# Altium schematic sheet DASH_V_3_LEDS_POWER.SchDoc
size A
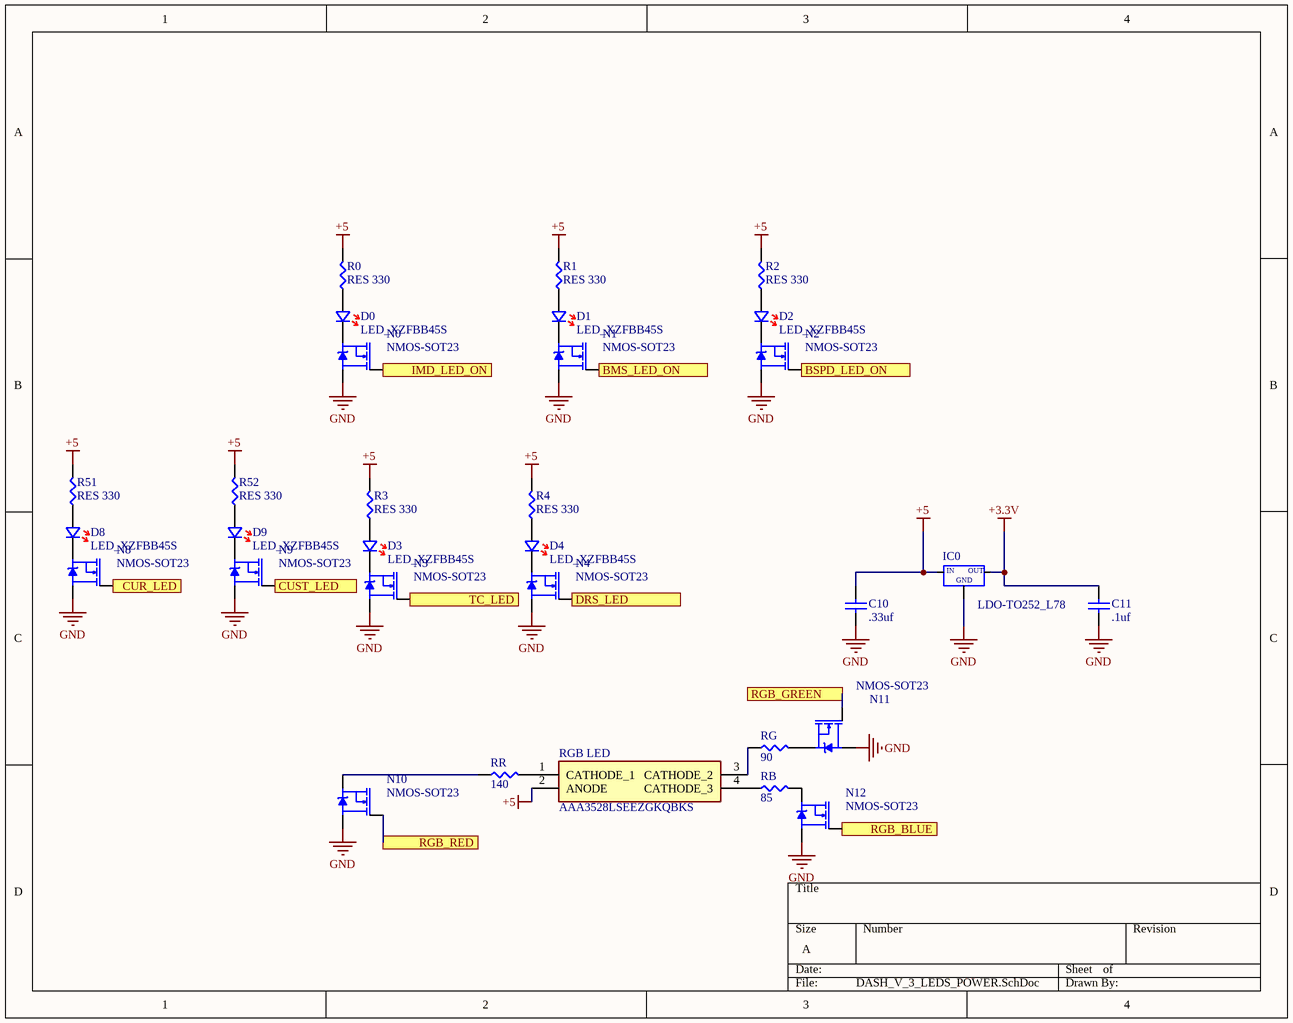
[diagram p0: DASH_V_3_LEDS_POWER.SchDoc]

## Parts
C10  .33uf  [CAPC1608X87X35NL15T15]
C11  .1uf  [CAPC1608X87X35NL15T15]
D0  LED_XZFBB45S  [LED_XZFBB45S]
D1  LED_XZFBB45S  [LED_XZFBB45S]
D2  LED_XZFBB45S  [LED_XZFBB45S]
D3  LED_XZFBB45S  [LED_XZFBB45S]
D4  LED_XZFBB45S  [LED_XZFBB45S]
D8  LED_XZFBB45S  [LED_XZFBB45S]
D9  LED_XZFBB45S  [LED_XZFBB45S]
IC0  LDO-TO252_L78  [TO252]
N0  NMOS-SOT23  [SOT23]
N1  NMOS-SOT23  [SOT23]
N2  NMOS-SOT23  [SOT23]
N3  NMOS-SOT23  [SOT23]
N4  NMOS-SOT23  [SOT23]
N8  NMOS-SOT23  [SOT23]
N9  NMOS-SOT23  [SOT23]
N10  NMOS-SOT23  [SOT23]
N11  NMOS-SOT23  [SOT23]
N12  NMOS-SOT23  [SOT23]
R0  RES 330  [RES-0603]
R1  RES 330  [RES-0603]
R2  RES 330  [RES-0603]
R3  RES 330  [RES-0603]
R4  RES 330  [RES-0603]
R51  RES 330  [RES-0603]
R52  RES 330  [RES-0603]
RB  85  [RES-0603]
RG  90  [RES-0603]
RGB_LED  AAA3528LSEEZGKQBKS  [AAA3528]
RR  140  [RES-0603]

## Ports
BMS_LED_ON, BSPD_LED_ON, CUR_LED, CUST_LED, DRS_LED, IMD_LED_ON, RGB_BLUE, RGB_GREEN, RGB_RED, TC_LED

## Nets
+3.3V: C11.2 IC0.3
+5: C10.2 IC0.1 R0.2 R1.2 R2.2 R3.2 R4.2 R51.2 R52.2 RGB_LED.2(ANODE)
GND: C10.1 C11.1 IC0.2 N0.2(S) N1.2(S) N2.2(S) N3.2(S) N4.2(S) N8.2(S) N9.2(S) N10.2(S) N11.2(S) N12.2(S)
BMS_LED_ON: N1.1(G) ; port BMS_LED_ON
BSPD_LED_ON: N2.1(G) ; port BSPD_LED_ON
CUR_LED: N8.1(G) ; port CUR_LED
CUST_LED: N9.1(G) ; port CUST_LED
DRS_LED: N4.1(G) ; port DRS_LED
IMD_LED_ON: N0.1(G) ; port IMD_LED_ON
RGB_BLUE: N12.1(G) ; port RGB_BLUE
RGB_GREEN: N11.1(G) ; port RGB_GREEN
RGB_RED: N10.1(G) ; port RGB_RED
TC_LED: N3.1(G) ; port TC_LED
NetD0_A: D0.A R0.1
NetD0_K: D0.K N0.3(D)
NetD1_A: D1.A R1.1
NetD1_K: D1.K N1.3(D)
NetD2_A: D2.A R2.1
NetD2_K: D2.K N2.3(D)
NetD3_A: D3.A R3.1
NetD3_K: D3.K N3.3(D)
NetD4_A: D4.A R4.1
NetD4_K: D4.K N4.3(D)
NetD8_A: D8.A R51.1
NetD8_K: D8.K N8.3(D)
NetD9_A: D9.A R52.1
NetD9_K: D9.K N9.3(D)
NetN10_3: N10.3(D) RR.1
NetN11_3: N11.3(D) RG.2
NetN12_3: N12.3(D) RB.2
NetRB_1: RB.1 RGB_LED.4(CATHODE_3)
NetRG_1: RG.1 RGB_LED.3(CATHODE_2)
NetRGB_LED_1: RGB_LED.1(CATHODE_1) RR.2

## Notes on the sheet
- (in symbol LDO-TO252_L78) IN; OUT; GND

## Library data of the parts
C10 C11 = CMP-2006-03887-1: .1 uf; Part Number: C0603C104J3RAC7867; Manufacturer: Kemet
R0-R4 R51 R52 RB RG RR = RES-0603
RGB_LED = AAA3528LSEEZGKQBKS: LED; Manufacturer_Name: Kingbright; Datasheet Link: https://componentsearchengine.com/Datasheets/1/AAA3528LSEEZGKQBKS.pdf; Mouser Part Number: 604-AAA3528LSEEZGKQB; Mouser Price/Stock: https://www.mouser.com/Search/Refine.aspx?Keyword=604-AAA3528LSEEZGKQB; Manufacturer_Part_Number: AAA3528LSEEZGKQBKS